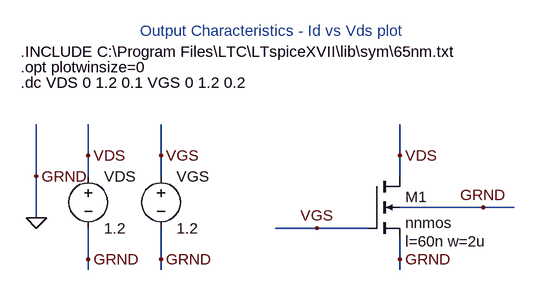
[diagram p0: schematic 2Output Characteristics - Id vs Vds plot.asc]
2Output Characteristics - Id vs Vds plot.asc, the LTspice schematic file:
Version 4
SHEET 1 880 680
WIRE -128 64 -128 16
WIRE -16 64 -16 16
WIRE 352 64 352 16
WIRE -208 96 -208 16
WIRE -128 96 -128 64
WIRE -16 96 -16 64
WIRE 352 96 352 64
WIRE 480 144 352 144
WIRE 528 144 480 144
WIRE -208 160 -208 96
WIRE 224 176 160 176
WIRE 304 176 224 176
WIRE -128 224 -128 176
WIRE -16 224 -16 176
WIRE 352 224 352 192
WIRE -128 240 -128 224
WIRE -16 240 -16 224
WIRE 352 240 352 224
FLAG -208 160 0
FLAG 224 176 VGS
FLAG -16 64 VGS
FLAG 352 64 VDS
FLAG -128 64 VDS
FLAG -208 96 GRND
FLAG 352 224 GRND
FLAG 480 144 GRND
FLAG -16 224 GRND
FLAG -128 224 GRND
SYMBOL nmos4 304 96 R0
WINDOW 123 56 100 Left 2
SYMATTR Value2 l=60n w=2u
SYMATTR InstName M1
SYMATTR Value nnmos
SYMBOL voltage -128 80 R0
SYMATTR InstName VDS
SYMATTR Value 1.2
SYMBOL voltage -16 80 R0
SYMATTR InstName VGS
SYMATTR Value 1.2
TEXT -232 -96 Left 2 !.INCLUDE C:\\Program Files\\LTC\\LTspiceXVII\\lib\\sym\\65nm.txt
TEXT -232 -72 Left 2 !.opt plotwinsize=0
TEXT -232 -48 Left 2 !.dc VDS 0 1.2 0.1 VGS 0 1.2 0.2
TEXT -48 -128 Left 2 ;Output Characteristics - Id vs Vds plot

The netlist it stands for:
* 2Output Characteristics - Id vs Vds plot.asc
M1 VDS VGS 0 0 nnmos l=60n w=2u
VDS VDS 0 1.2
VGS VGS 0 1.2
.model NMOS NMOS
.model PMOS PMOS
.lib standard.mos
.INCLUDE C:\Program Files\LTC\LTspiceXVII\lib\sym\65nm.txt
.opt plotwinsize=0
.dc VDS 0 1.2 0.1 VGS 0 1.2 0.2
* Output Characteristics - Id vs Vds plot
.backanno
.end